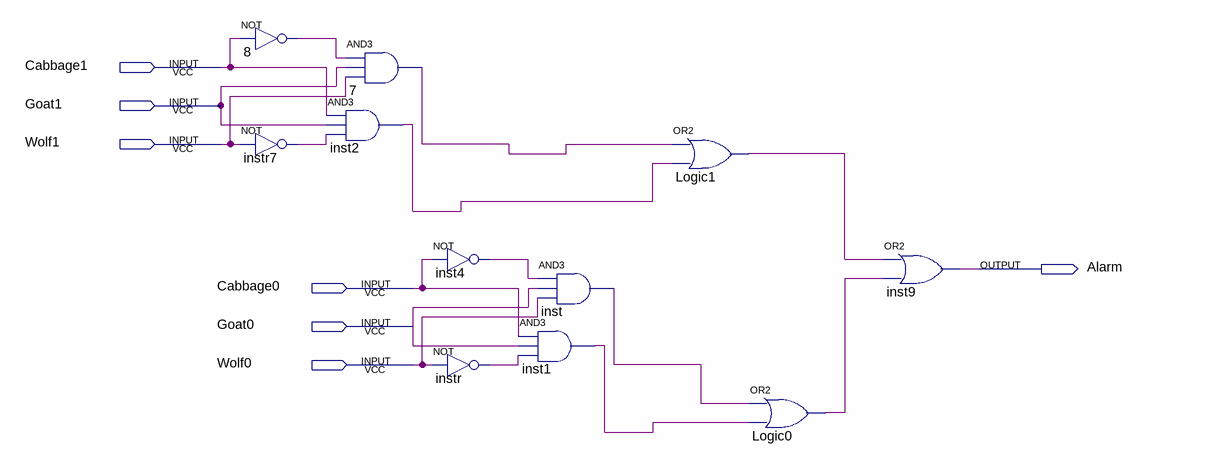
[diagram p0: schematic sheet]
// Quartus schematic lab2step2.bdf as structural Verilog: 11 symbols, 7 pins
module lab2step2 (
  input  Cabbage1,
  input  Goat1,
  input  Wolf1,
  input  Cabbage0,
  input  Goat0,
  input  Wolf0,
  output Alarm
);

  wire inst1_out, inst2_out, inst4_out, inst_out, instr7_out, instr_out, Logic0_out, Logic1_out, n7_out,
       n8_out;

  not u_8 (n8_out, Cabbage1);
  not instr7 (instr7_out, Wolf1);
  and inst2 (inst2_out, Cabbage1, Goat1, instr7_out);
  and u_7 (n7_out, n8_out, Goat1, Wolf1);
  not inst4 (inst4_out, Cabbage0);
  not instr (instr_out, Wolf0);
  and inst (inst_out, inst4_out, Goat0, Wolf0);
  and inst1 (inst1_out, Cabbage0, Goat0, instr_out);
  or Logic1 (Logic1_out, n7_out, inst2_out);
  or Logic0 (Logic0_out, inst_out, inst1_out);
  or inst9 (Alarm, Logic1_out, Logic0_out);
endmodule
